# EAGLE design wavplayer-v2 (EAGLE 6.5.0)
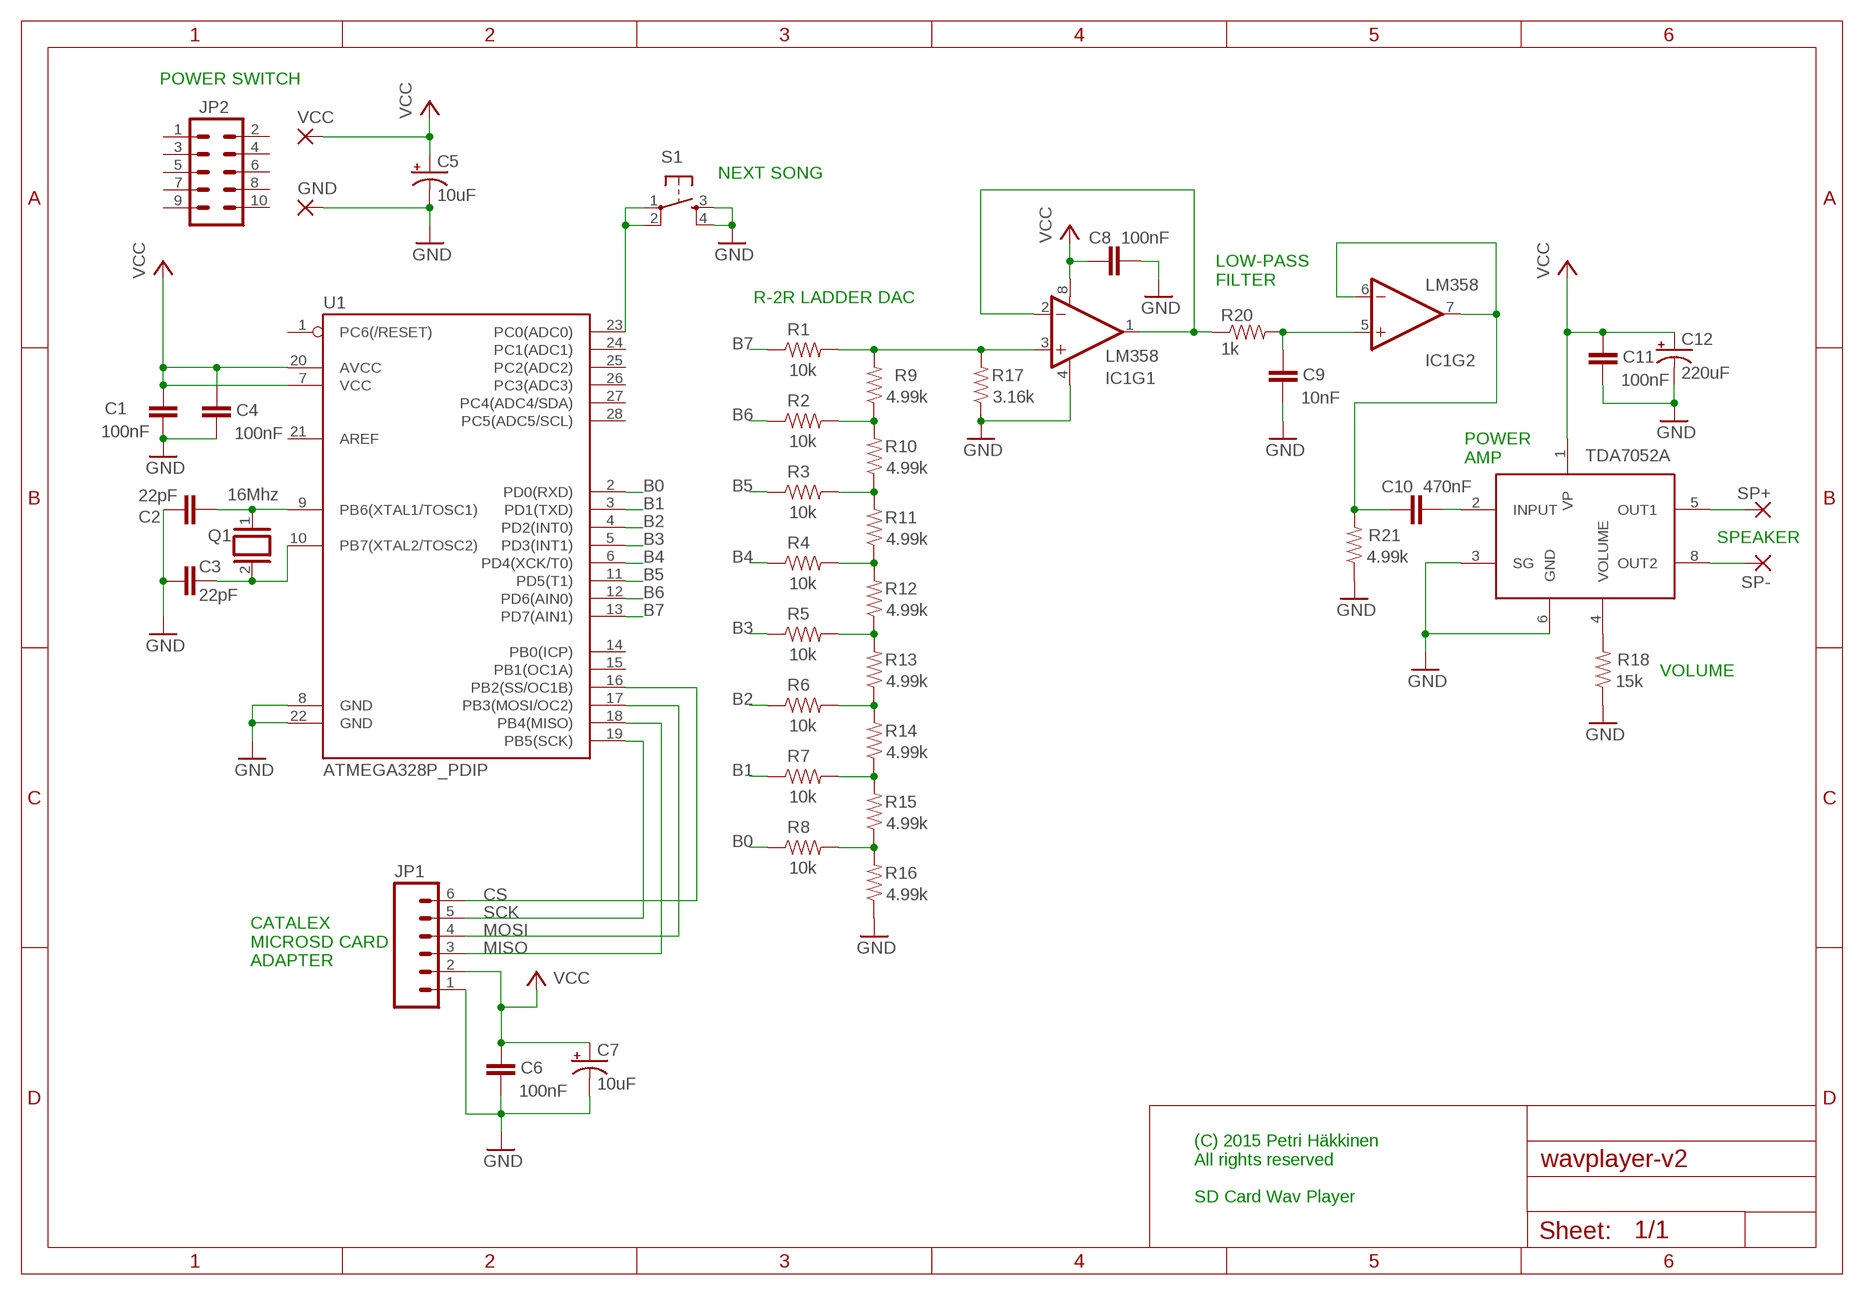
[diagram p0: schematic, sheet 1]

## Parts
C1  100nF  CAPPTH  [CAP-PTH-SMALL]
C2  22pF  CAPPTH  [CAP-PTH-SMALL]
C3  22pF  CAPPTH  [CAP-PTH-SMALL]
C4  100nF  CAPPTH  [CAP-PTH-SMALL]
C5  10uF  CAP_POLPTH1  [CPOL-RADIAL-100UF-25V]
C6  100nF  CAPPTH  [CAP-PTH-SMALL]
C7  10uF  CAP_POLPTH1  [CPOL-RADIAL-100UF-25V]
C8  100nF  CAPPTH  [CAP-PTH-SMALL]
C9  10nF  CAPPTH  [CAP-PTH-SMALL]
C10  470nF  CAPPTH  [CAP-PTH-SMALL]
C11  100nF  CAPPTH  [CAP-PTH-SMALL]
C12  220uF  CAP_POLPTH1  [CPOL-RADIAL-100UF-25V]
GND  WIREPAD2,54/0,8  [2,54/0,8]
IC1  LM358  [DIP08]
JP1  M06LONGPADS  [1X06_LONGPADS]
JP2  M05X2NO_SILK  [2X5_NOSILK]
Q1  16Mhz  XTAL/S  [QS]
R1  10k  RESISTORPTH-1/4W  [AXIAL-0.4]
R2  10k  RESISTORPTH-1/4W  [AXIAL-0.4]
R3  10k  RESISTORPTH-1/4W  [AXIAL-0.4]
R4  10k  RESISTORPTH-1/4W  [AXIAL-0.4]
R5  10k  RESISTORPTH-1/4W  [AXIAL-0.4]
R6  10k  RESISTORPTH-1/4W  [AXIAL-0.4]
R7  10k  RESISTORPTH-1/4W  [AXIAL-0.4]
R8  10k  RESISTORPTH-1/4W  [AXIAL-0.4]
R9  4.99k  RESISTORPTH-1/4W  [AXIAL-0.4]
R10  4.99k  RESISTORPTH-1/4W  [AXIAL-0.4]
R11  4.99k  RESISTORPTH-1/4W  [AXIAL-0.4]
R12  4.99k  RESISTORPTH-1/4W  [AXIAL-0.4]
R13  4.99k  RESISTORPTH-1/4W  [AXIAL-0.4]
R14  4.99k  RESISTORPTH-1/4W  [AXIAL-0.4]
R15  4.99k  RESISTORPTH-1/4W  [AXIAL-0.4]
R16  4.99k  RESISTORPTH-1/4W  [AXIAL-0.4]
R17  3.16k  RESISTORPTH-1/4W  [AXIAL-0.4]
R18  15k  RESISTORPTH-1/4W-VERT  [AXIAL-0.1]
R20  1k  RESISTORPTH-1/4W  [AXIAL-0.4]
R21  4.99k  RESISTORPTH-1/4W  [AXIAL-0.4]
S1  TAC_SWITCHPTH  [TACTILE-PTH]
SP+  WIREPAD3,17/1,1  [3,17/1,1]
SP-  WIREPAD3,17/1,1  [3,17/1,1]
U1  ATMEGA328P_PDIP  [DIL28-3]
U$1  TDA7052B  [DIL08]
VCC  WIREPAD2,54/0,8  [2,54/0,8]

## Nets
B0: R8.P$1 U1.2(PD0(RXD))
B1: R7.P$1 U1.3(PD1(TXD))
B2: R6.P$1 U1.4(PD2(INT0))
B3: R5.P$1 U1.5(PD3(INT1))
B4: R4.P$1 U1.6(PD4(XCK/T0))
B5: R3.P$1 U1.11(PD5(T1))
B6: R2.P$1 U1.12(PD6(AIN0))
B7: R1.P$1 U1.13(PD7(AIN1))
CS: JP1.6 U1.16(PB2(SS/OC1B))
GND: C1.2 C2.2 C3.2 C4.2 C5.2(-) C6.2 C7.2(-) C8.2 C9.2 C11.2 C12.2(-) GND.1(P) IC1.4(V-) JP1.1 R16.P$1 R17.P$1 R18.P$1 R21.P$1 S1.3 S1.4 U1.8(GND) U1.22(GND) U$1.3(SG) U$1.6(GND)
MISO: JP1.3 U1.18(PB4(MISO))
MOSI: JP1.4 U1.17(PB3(MOSI/OC2))
N$1: C2.1 Q1.1 U1.9(PB6(XTAL1/TOSC1))
N$2: C3.1 Q1.2 U1.10(PB7(XTAL2/TOSC2))
N$3: R4.P$2 R11.P$1 R12.P$2
N$4: R5.P$2 R12.P$1 R13.P$2
N$5: R6.P$2 R13.P$1 R14.P$2
N$6: R3.P$2 R10.P$1 R11.P$2
N$7: R7.P$2 R14.P$1 R15.P$2
N$8: R2.P$2 R9.P$1 R10.P$2
N$9: R8.P$2 R15.P$1 R16.P$2
N$10: IC1.3(+IN) R1.P$2 R9.P$2 R17.P$2
N$11: C9.1 IC1.5(+IN) R20.P$2
N$12: C10.1 IC1.6(-IN) IC1.7(OUT) R21.P$2
N$13: IC1.1(OUT) IC1.2(-IN) R20.P$1
N$14: SP-.1(P) U$1.8(OUT2)
N$16: SP+.1(P) U$1.5(OUT1)
N$18: C10.2 U$1.2(INPUT)
N$19: R18.P$2 U$1.4(VOLUME)
N$25: S1.1 S1.2 U1.23(PC0(ADC0))
SCK: JP1.5 U1.19(PB5(SCK))
VCC: C1.1 C4.1 C5.1(+) C6.1 C7.1(+) C8.1 C11.1 C12.1(+) IC1.8(V+) JP1.2 U1.7(VCC) U1.20(AVCC) U$1.1(VP) VCC.1(P)
Unconnected: JP2.1 JP2.2 JP2.3 JP2.4 JP2.5 JP2.6 JP2.7 JP2.8 JP2.9 JP2.10 U1.1(PC6(/RESET)) U1.14(PB0(ICP)) U1.15(PB1(OC1A)) U1.21(AREF) U1.24(PC1(ADC1)) U1.25(PC2(ADC2)) U1.26(PC3(ADC3)) U1.27(PC4(ADC4/SDA)) U1.28(PC5(ADC5/SCL))

## Notes on the sheet
- POWER SWITCH
- NEXT SONG
- LOW-PASS
  FILTER
- R-2R LADDER DAC
- TDA7052A
- POWER
  AMP
- SPEAKER
- VOLUME
- CATALEX
  MICROSD CARD
  ADAPTER
- (C) 2015 Petri Häkkinen
  All rights reserved
  
  SD Card Wav Player

## Library data of the parts
C1-C4 C6 C8-C11 = SparkFun-Capacitors:CAP: Capacitor Standard 0603 ceramic capacitor, and 0.1" leaded capacitor.
C5 C7 C12 = SparkFun-Capacitors:CAP_POL: Capacitor Polarized These are standard SMD and PTH capacitors. Normally 10uF, 47uF, and 100uF in electrolytic and tantalum varieties. Always verify the external diameter of the through hole cap, it varies with capacity, voltage, and manufacturer. The EIA devices should be standard.
GND SP+ SP- VCC = wirepad:WIREPAD: Wire PAD connect wire on PCB
IC1 = SparkFun-AnalogIC:LM358: Jellybean op-amp; PROD_ID: IC-09172
JP1 = SparkFun-Connectors:M06: Header 6 Standard 6-pin 0.1" header. Use with straight break away headers (SKU : PRT-00116), right angle break away headers (PRT-00553), swiss pins (PRT-00743), machine pins (PRT-00117), and female headers (PRT-00115). Molex polarized connector foot print use with SKU : PRT-08094 with associated crimp pins and housings. NOTES ON THE VARIANTS LOCK and LOCK_LONGPADS... This footprint was designed to help hold the alignment of a through-hole component (i.e. 6-pin header) while soldering it into place. You may notice that each hole has been shifted either up or down by 0.005 of an inch from it's more standard position (which is a perfectly straight line). This slight alteration caused the pins (the squares in the middle) to touch the edges of the holes. Because they are alternating, it causes a "brace" to hold the component in place. 0.005 has proven to be the perfect amount of "off-center" position when using our standard breakaway headers. Although looks a little odd when you look at the bare footprint, once you have a header in there, the alteration is very hard to notice. Also,if you push a header all the way into place, it is covered up entirely on the bottom side. This idea of altering the position of holes to aid alignment will be further integrated into the Sparkfun Library for other footprints. It can help hold any component with 3 or more connection pins.
JP2 = SparkFun-Connectors:M05X2: Header 5x2 Standard 10-pin dual row 0.1" header. Commonly used with AVR-ISP. Use with Spark Fun Electronics SKU: PRT-00778
Q1 = special:XTAL/S: CRYSTAL
R1-R17 R20 R21 = SparkFun-Passives:RESISTOR: Resistor Basic schematic elements and footprints for 0603, 1206, and PTH resistors.
R18 = SparkFun-Resistors:RESISTOR: Resistor Basic schematic elements and footprints for 0603, 1206, and PTH resistors.
S1 = SparkFun-Electromechanical:TAC_SWITCH: Momentary Switch Button commonly used for reset or general input. Spark Fun Electronics SKU : COM-00097 SMT- SWCH-08247
U1 = SparkFun-DigitalIC:ATMEGA328P_PDIP: uC used in the Arduino 32kb flash, 1k EEPROM, 2k SRAM This is the through-hole version of this chip.
U$1 = tda7052b:TDA7052B: 1W Mono audio amplifier

## Board
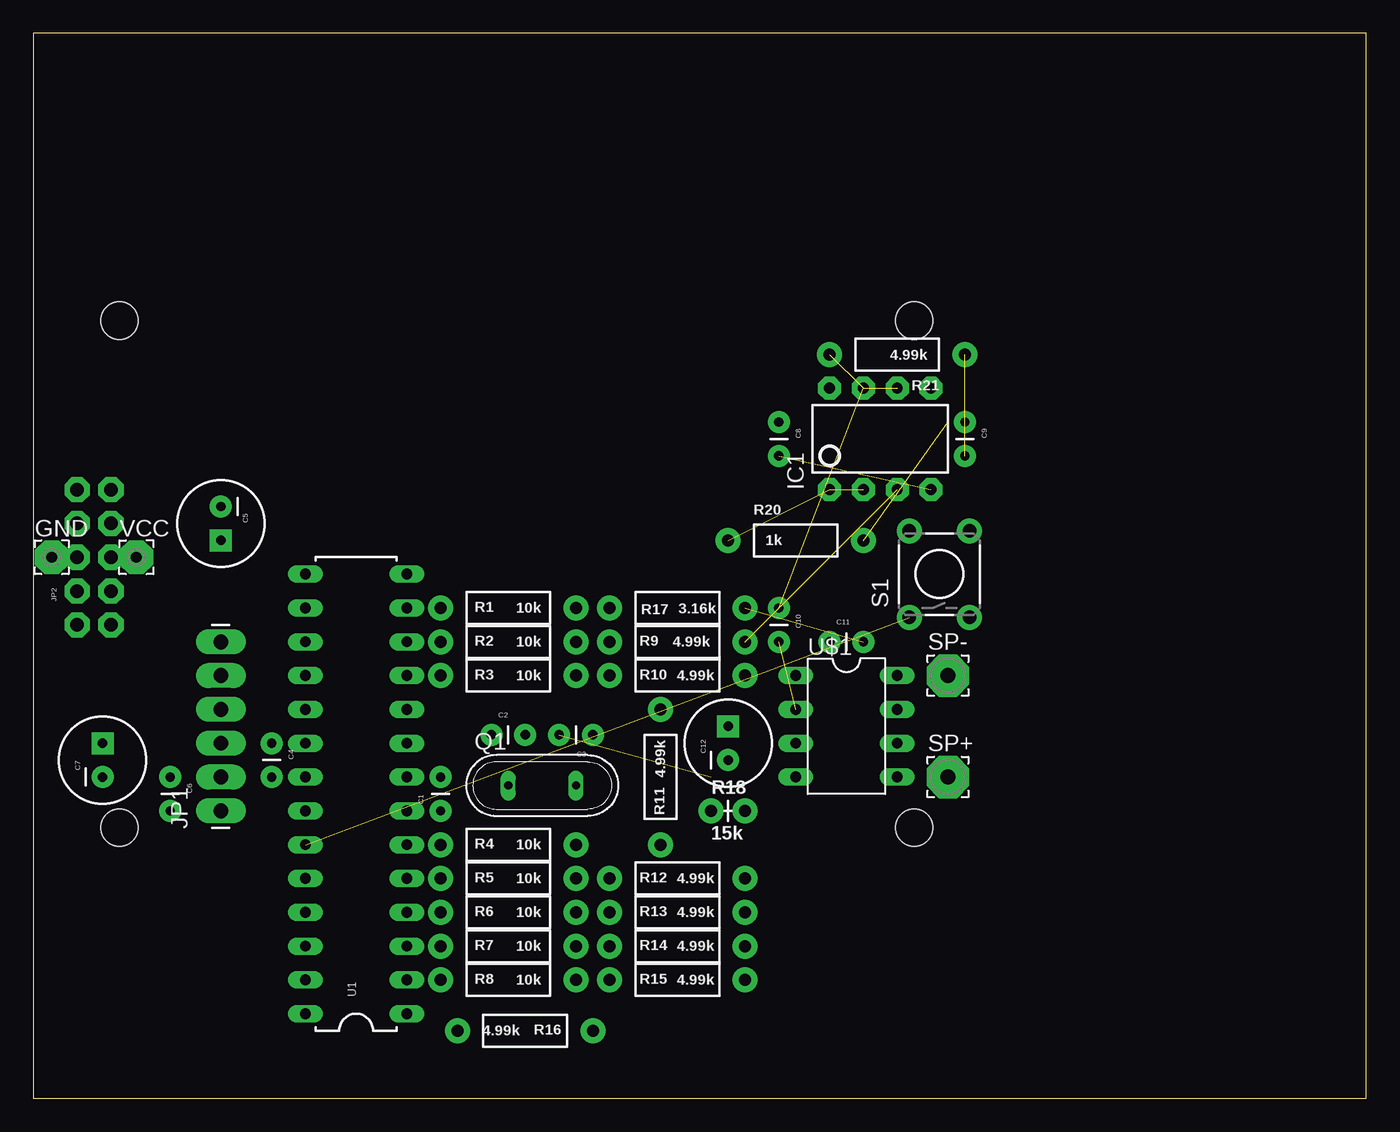
[diagram p1: board, top side]
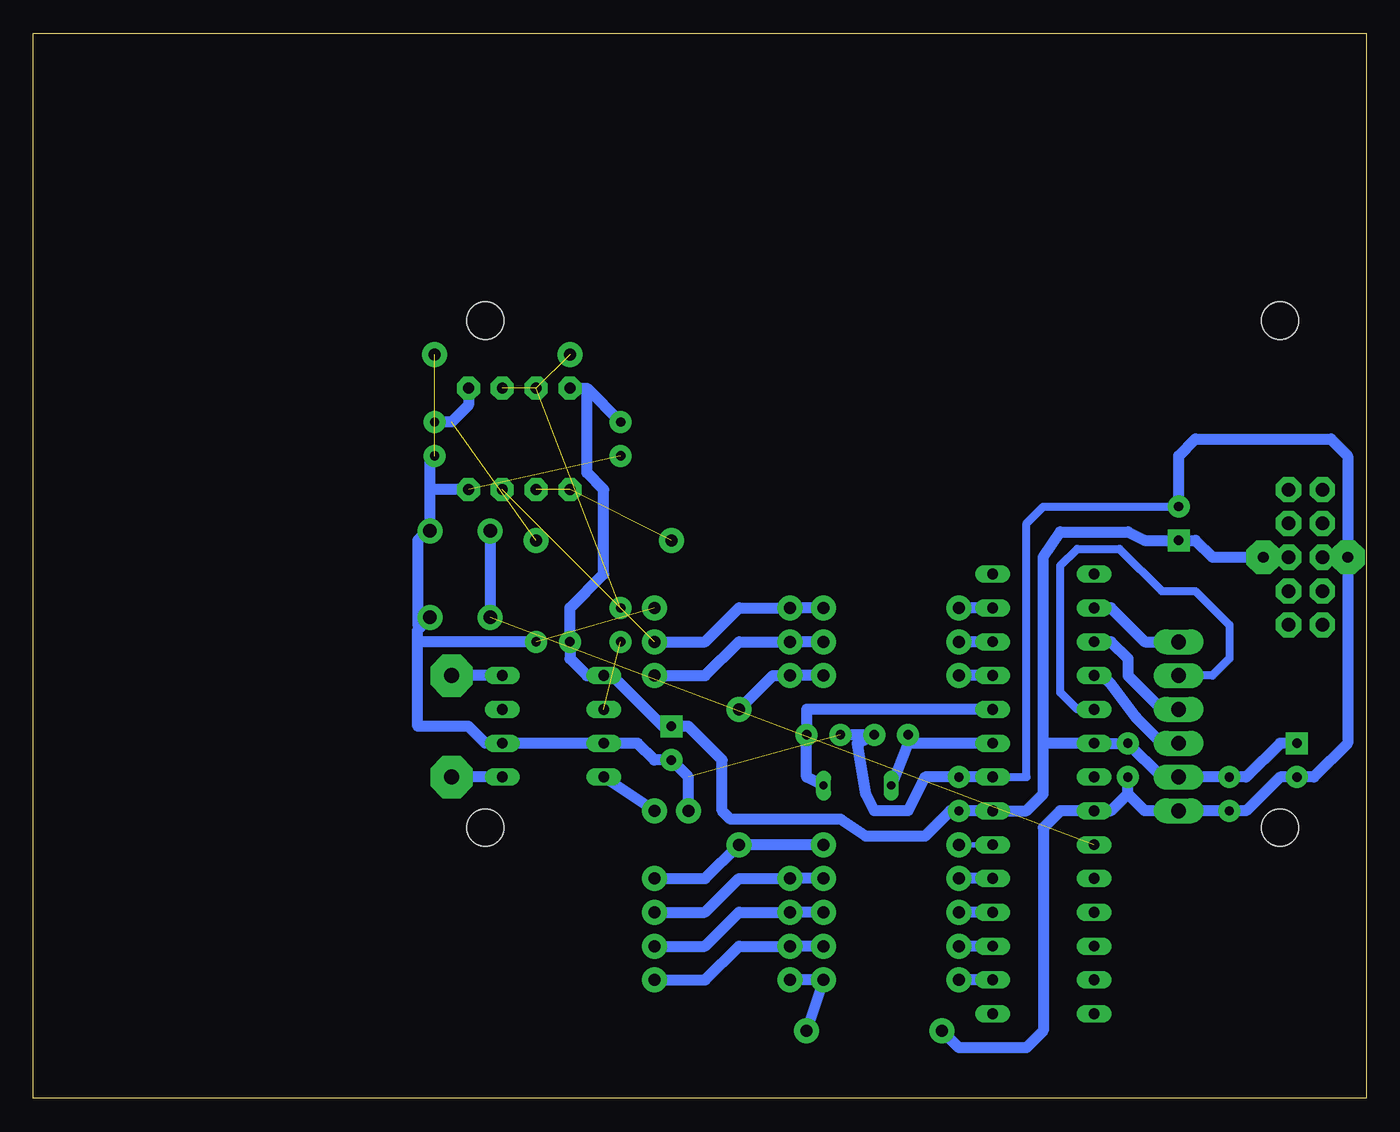
[diagram p2: board, bottom side, seen from below]

Size 100.12 x 80 mm. Coordinates in mm from the lower left corner, seen from the top.
Outline: 0,0 100.12,0 100.12,80 0,80 0,0
Copper layers (1*16): Top 0.035mm / dielectric 1.5mm / Bottom 0.035mm
Design rules "default": minimum track width 10mil, minimum drill 24mil, track to track 8mil, track to pad 8mil, pad to pad 8mil, via to via 8mil, smd to smd 8mil, copper to edge 40mil, drill to drill 8mil, minimum pad ring 10mil, minimum via ring 8mil, stop-mask expansion 4mil, vias tented up to drill 0mil, thermal gap 10mil
Holes 2.8 mm at 6.47,58.42 6.47,20.32 66.16,58.42 66.16,20.32

### Footprints (pad centres in the part's own frame; a part is rotated, then mirrored left to right if it is on the bottom)
CAP-PTH-SMALL = drill 0.7 pad 1.651: 1 0,0; 2 2.54,0
CPOL-RADIAL-100UF-25V = drill 0.7 pad 1.651 square: 1 1.27,0 | drill 0.7 pad 1.651: 2 -1.27,0
2,54/0,8 = drill 0.813 pad 2.54 octagon: 1 0,0
DIP08 = drill 0.813 pad 1.727 octagon: 1 -3.81,-3.81; 2 -1.27,-3.81; 3 1.27,-3.81; 4 3.81,-3.81; 5 3.81,3.81; 6 1.27,3.81; 7 -1.27,3.81; 8 -3.81,3.81
1X06_LONGPADS = drill 1.118 pad 1.88 long: 1 0,0; 2 2.54,0; 3 5.08,0; 4 7.62,0; 5 10.16,0; 6 12.7,0
2X5_NOSILK = drill 1.016 pad 1.88 octagon: 1 -1.27,5.08; 2 1.27,5.08; 3 -1.27,2.54; 4 1.27,2.54; 5 -1.27,0; 6 1.27,0; 7 -1.27,-2.54; 8 1.27,-2.54; 9 -1.27,-5.08; 10 1.27,-5.08
QS = drill 0.61 long: 1 -2.54,0; 2 2.54,0
AXIAL-0.4 = drill 0.9 pad 1.88: P$1 -5.08,0; P$2 5.08,0
AXIAL-0.1 = drill 0.9 pad 1.88: P$1 0,0; P$2 2.54,0
TACTILE-PTH = drill 1.016 pad 1.88: 1 -3.251,2.261; 2 3.251,2.261; 3 -3.251,-2.261; 4 3.251,-2.261
3,17/1,1 = drill 1.118 pad 3.175 octagon: 1 0,0
DIL28-3 = drill 0.813 long: 1 -16.51,-3.81; 2 -13.97,-3.81; 3 -11.43,-3.81; 4 -8.89,-3.81; 5 -6.35,-3.81; 6 -3.81,-3.81; 7 -1.27,-3.81; 8 1.27,-3.81; 9 3.81,-3.81; 10 6.35,-3.81; 11 8.89,-3.81; 12 11.43,-3.81; 13 13.97,-3.81; 14 16.51,-3.81; 15 16.51,3.81; 16 13.97,3.81; 17 11.43,3.81; 18 8.89,3.81; 19 6.35,3.81; 20 3.81,3.81; 21 1.27,3.81; 22 -1.27,3.81; 23 -3.81,3.81; 24 -6.35,3.81; 25 -8.89,3.81; 26 -11.43,3.81; 27 -13.97,3.81; 28 -16.51,3.81
DIL08 = drill 0.813 long: 1 -3.81,-3.81; 2 -1.27,-3.81; 3 1.27,-3.81; 4 3.81,-3.81; 5 3.81,3.81; 6 1.27,3.81; 7 -1.27,3.81; 8 -3.81,3.81

### Placement (x,y rotation side)
C1  30.6,21.59 90 top
C2  34.41,27.3 0 top
C3  42.03,27.3 180 top
C4  17.9,26.67 270 top
C5  14.09,43.18 270 top
C6  10.28,24.13 270 top
C7  5.2,25.4 90 top
C8  56,50.8 270 top
C9  69.97,50.8 270 top
C10  56,36.83 270 top
C11  59.81,34.29 0 top
C12  52.19,26.67 90 top
GND  1.39,40.64 0 top
IC1  63.62,49.53 0 top
JP1  14.09,21.59 90 top
JP2  4.56,40.64 0 top
Q1  38.22,23.5 0 top
R1  35.68,36.83 0 top
R2  35.68,34.29 0 top
R3  35.68,31.75 0 top
R4  35.68,19.05 0 top
R5  35.68,16.51 0 top
R6  35.68,13.97 0 top
R7  35.68,11.43 0 top
R8  35.68,8.89 0 top
R9  48.38,34.29 0 top
R10  48.38,31.75 0 top
R11  47.11,24.13 90 top
R12  48.38,16.51 0 top
R13  48.38,13.97 0 top
R14  48.38,11.43 0 top
R15  48.38,8.89 0 top
R16  36.95,5.08 0 top
R17  48.38,36.83 180 top
R18  50.92,21.59 0 top
R20  57.27,41.91 0 top
R21  64.89,55.88 180 top
S1  68.06,39.37 90 top
SP+  68.7,24.13 0 top
SP-  68.7,31.75 0 top
U1  24.25,22.86 90 top
U$1  61.08,27.94 270 top
VCC  7.74,40.64 0 top

### Tracks (layer width: path | path; a pad name or v marks a point on that pad's centre or on a via)
B0
  Bottom 0.813: U1.2 R8.P$1
B1
  Bottom 0.813: U1.3 R7.P$1
B2
  Bottom 0.813: U1.4 R6.P$1
B3
  Bottom 0.813: U1.5 R5.P$1
B4
  Bottom 0.406: U1.6 R4.P$1
B5
  Bottom 0.813: U1.11 R3.P$1
B6
  Bottom 0.813: U1.12 R2.P$1
B7
  Bottom 0.813: U1.13 R1.P$1
CS
  Bottom 0.813: U1.16 19.17,36.83 16.63,34.29 JP1.6
GND  (4 unrouted)
  Bottom 0.61: U1.8 25.52,24.13 25.52,43.18 24.25,44.45 C5.2
  Bottom 0.813: R16.P$1 30.6,3.81 25.52,3.81 24.25,5.08 24.25,20.32 22.98,21.59 U1.22 19.17,21.59 17.9,22.86 | 17.9,22.86 C4.2 | 17.9,22.86 16.63,21.59 JP1.1 C6.2 9.01,21.59 6.47,24.13 C7.2 3.93,24.13 1.39,26.67 GND.1 1.39,48.26 2.66,49.53 12.82,49.53 14.09,48.26 C5.2 | 71.24,34.29 71.24,27.94 67.43,27.94 66.16,26.67 U$1.6 U$1.3 54.73,26.67 53.46,25.4 C12.2 50.92,24.13 R18.P$1 | 71.24,34.29 71.24,35.2 71.06,35.38 | 71.06,35.38 S1.3 | 71.06,35.38 71.24,35.56 71.24,41.91 70.53,42.62 S1.4 70.33,45.72 | C11.2 71.24,34.29 | 70.33,45.72 70.33,47.9 C9.2 | IC1.4 70.33,45.72 | U1.8 C1.2 33.14,24.13 34.41,21.59 36.95,21.59 37.58,22.86 38.22,26.67 C2.2 C3.2
MISO
  Bottom 0.813: JP1.3 15.36,26.67 17.26,28.57 19.17,31.11 19.8,31.75 U1.18
MOSI
  Bottom 0.813: U1.17 19.17,34.29 17.9,33.02 17.9,31.75 15.36,29.21 JP1.4
N$1
  Bottom 0.813: U1.9 34.41,26.67 | 34.41,26.67 Q1.1 | 34.41,26.67 C2.1
N$2
  Bottom 0.813: U1.10 42.03,29.21 C3.1 42.03,24.13 Q1.2
N$3
  Bottom 0.813: R4.P$2 R11.P$1 49.65,16.51 R12.P$2
N$4
  Bottom 0.813: R5.P$2 R12.P$1 47.11,16.51 49.65,13.97 R13.P$2
N$5
  Bottom 0.813: R6.P$2 R13.P$1 47.11,13.97 49.65,11.43 R14.P$2
N$6
  Bottom 0.813: R3.P$2 R10.P$1 44.57,31.75 R11.P$2
N$7
  Bottom 0.813: R7.P$2 R14.P$1 47.11,11.43 49.65,8.89 R15.P$2
N$8
  Bottom 0.813: R2.P$2 R9.P$1 47.11,34.29 49.65,31.75 R10.P$2
N$9
  Bottom 0.813: R15.P$1 R8.P$2 R16.P$2
N$10  (1 unrouted)
  Bottom 0.813: R1.P$2 R17.P$2 47.11,36.83 49.65,34.29 R9.P$2
N$11  (1 unrouted)
  Bottom 0.813: IC1.5 67.43,52.07 68.7,50.8 C9.1
N$12  (3 unrouted)
N$13  (2 unrouted)
N$14
  Bottom 0.813: U$1.8 SP-.1
N$16
  Bottom 0.813: U$1.5 SP+.1
N$17
  cutout Top: 33.14,0 38.22,0 43.3,0.64 49.01,2.54 53.46,4.45 55.36,5.71 55.68,6.03 55.68,19.37 61.71,19.37 62.98,18.73 63.94,17.78 64.89,16.51 64.89,15.88 67.11,15.88 68.06,17.46 69.33,19.68 71.24,23.18 72.51,26.35 72.51,52.07 70.6,56.52 69.02,59.05 67.75,60.96 66.79,62.23 66.79,62.55 64.89,62.55 64.57,61.28 63.94,60.33 62.98,59.69 59.17,56.2 58.54,55.56 54.09,51.75 52.82,49.21 49.97,45.72 46.47,43.18 42.35,41.59 38.85,40.64 33.77,40.64 30.6,41.27 27.11,42.86 24.25,44.45 21.39,46.99 19.8,49.21 18.53,51.75 16.63,53.02 14.41,55.24 9.33,59.69 8.37,60.64 7.74,62.23 7.74,62.55 5.83,62.55 3.93,59.69 1.71,55.56 0.12,52.07 0.12,26.04 1.07,24.13 2.34,21.27 3.93,18.41 5.83,15.88 7.74,15.88 8.06,17.14 9.01,18.41 10.6,19.37 16.95,19.37 16.95,6.03 18.22,5.08 23.93,2.22 31.55,0.32
N$18  (1 unrouted)
N$19
  Bottom 0.813: R18.P$2 U$1.4
N$25  (1 unrouted)
  Bottom 0.813: S1.2 S1.1
SCK
  Bottom 0.61: U1.19 21.71,29.21 22.98,30.48 22.98,40.01 21.71,41.27 18.53,41.27 15.36,38.1 12.82,38.1 10.28,35.56 10.28,33.02 11.55,31.75 JP1.5
VCC
  Bottom 0.813: 24.25,26.67 24.25,22.86 25.52,21.59 U1.7 C1.1 31.23,21.59 33.14,19.68 37.58,19.68 39.49,20.95 47.11,20.95 47.74,20.95 48.38,21.59 48.38,25.4 50.92,27.94 C12.1 52.82,27.94 56.63,31.75 U$1.1 58.54,31.75 59.81,33.02 C11.1 59.81,36.83 57.27,39.37 57.27,45.72 58.54,46.99 58.54,53.34 | 24.25,26.67 24.25,40.64 22.98,42.55 17.9,42.55 16.63,41.91 C5.1 12.82,41.91 11.55,40.64 VCC.1 | 24.25,26.67 U1.20 C4.1 15.36,24.13 JP1.2 C6.1 9.01,24.13 6.47,26.67 C7.1 | IC1.8 58.54,53.34 | 58.54,53.34 C8.1

### Text on the board
Vias: TODO: / RGB led
201bmp: /Users/petri/Dropbox/Elektroniikka/eino_wavplayer/eino_pcb_150dpi.bmp